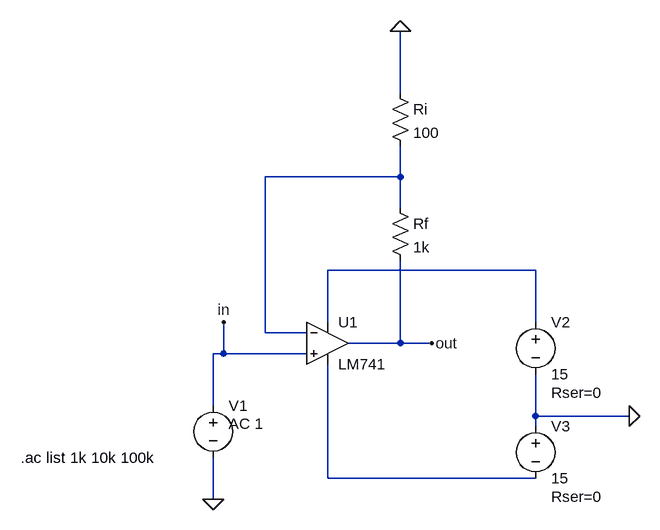
[diagram p0: schematic LM741nonInverting.asc]
LM741nonInverting.asc, the LTspice schematic file:
Version 4
SHEET 1 880 680
WIRE 304 -240 304 -336
WIRE 304 -112 304 -160
WIRE 304 -112 96 -112
WIRE 304 -64 304 -112
WIRE 512 32 192 32
WIRE 192 112 192 32
WIRE 512 112 512 32
WIRE 96 128 96 -112
WIRE 160 128 96 128
WIRE 304 144 304 16
WIRE 304 144 224 144
WIRE 352 144 304 144
WIRE 32 160 32 112
WIRE 32 160 16 160
WIRE 160 160 32 160
WIRE 16 240 16 160
WIRE 512 256 512 192
WIRE 656 256 512 256
WIRE 512 272 512 256
WIRE 192 352 192 176
WIRE 512 352 192 352
WIRE 16 384 16 320
FLAG 16 384 0
FLAG 32 112 in
FLAG 352 144 out
FLAG 656 256 0
FLAG 304 -336 0
SYMBOL LM741 192 80 R0
SYMATTR InstName U1
SYMBOL voltage 512 96 R0
WINDOW 123 0 0 Left 0
WINDOW 39 24 124 Left 2
SYMATTR SpiceLine Rser=0
SYMATTR InstName V2
SYMATTR Value 15
SYMBOL voltage 16 224 R0
WINDOW 3 24 44 Left 2
WINDOW 123 24 44 Left 2
WINDOW 39 0 0 Left 0
SYMATTR Value ""
SYMATTR Value2 AC 1
SYMATTR InstName V1
SYMBOL res 288 -80 R0
SYMATTR InstName Rf
SYMATTR Value 1k
SYMBOL res 288 -256 R0
SYMATTR InstName Ri
SYMATTR Value 100
SYMBOL voltage 512 256 R0
WINDOW 123 0 0 Left 0
WINDOW 39 24 124 Left 2
SYMATTR InstName V3
SYMATTR Value 15
SYMATTR SpiceLine Rser=0
TEXT -280 320 Left 2 !.ac list 1k 10k 100k

The netlist it stands for:
* LM741nonInverting.asc
XU1 in N001 N002 N003 out LM741  ; pins In+ In- V+ V- OUT
V2 N002 0 15 Rser=0
V1 in 0 AC 1
Rf N001 out 1k
Ri 0 N001 100
V3 0 N003 15 Rser=0
.ac list 1k 10k 100k
.lib LM741.lib
.backanno
.end